# Altium schematic sheet POWER_PART.SchDoc
size A4
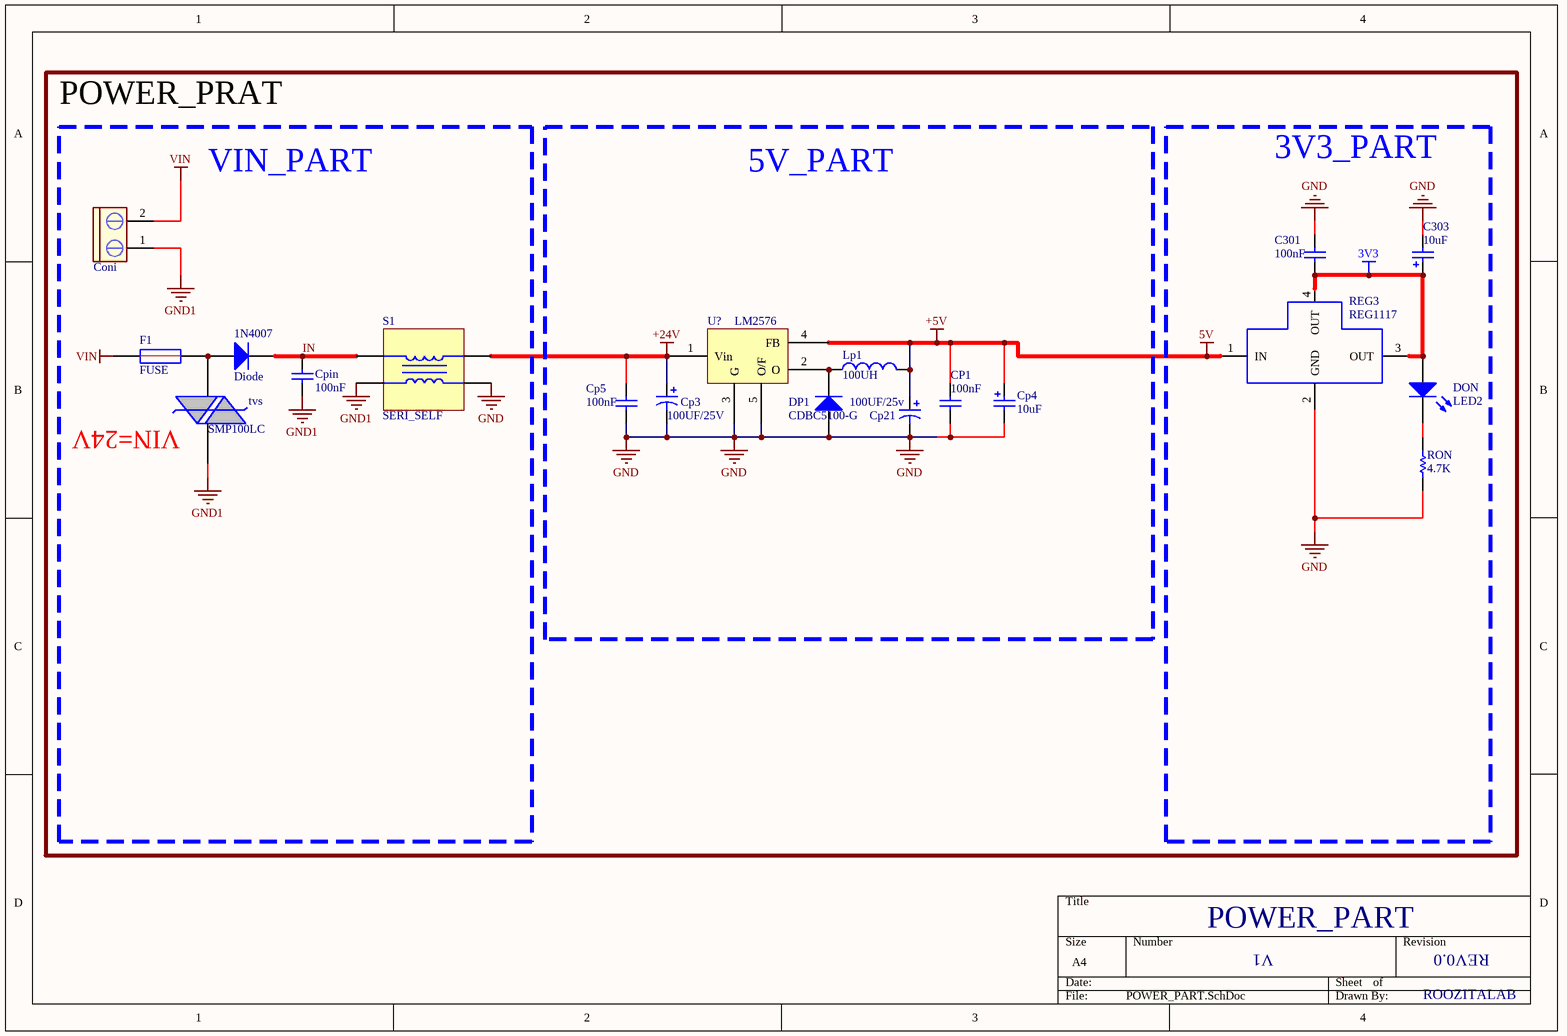
[diagram p0: POWER_PART.SchDoc]

## Parts
1N4007  Diode  [SMB]
C301  100nF  [0805.]
C303  10uF  [C1206.]
Coni  CON2 pin blue  [My_CN2]  (value not drawn)
CP1  100nF  [0805.]
Cp3  value 100UF/25V  [100UF25V]  (hidden comment: Cap Pol1)
Cp4  10uF  [C1206.]
Cp5  100nF  [0805.]
Cp21  value 100UF/25v  [100UF25V]  (hidden comment: Cap Pol1)
Cpin  100nF  [0805.]
DON  LED2  [0805.]
DP1  CDBC5100-G  [MY_SMC]
F1  FUSE  [1206]
Lp1  value 100UH  [indoctor100u]  (hidden comment: Inductor)
REG3  REG1117  [REG SMD]
RON  4.7K  [0805.]
S1  SERI_SELF  [SERI_SELF_SMALL]
tvs  SMP100LC  [TVS]
U?  LM2576  [d2pak5-lead]

## Nets
3V3: C301.1 C303.1 DON.1(A) REG3.3(OUT) REG3.4(OUT)
+5V: CP1.2 Cp4.1 Cp21.1 Lp1.2 REG3.1(IN) U?.4(FB)  [also labelled 5V]
+24V: Cp3.1 Cp5.2 S1.3 U?.1(Vin)
GND: C301.2 C303.2 CP1.1 Cp3.2 Cp4.2 Cp5.1 Cp21.2 DP1.A REG3.2(GND) RON.1 S1.4 U?.3(G) U?.5(O/F)
GND1: Coni.1 Cpin.2 S1.2 tvs.2
VIN: Coni.2 F1.2
IN: 1N4007.2(K) Cpin.1 S1.1
Net1N4007_1: 1N4007.1(A) F1.1 tvs.1
NetDON_2: DON.2(K) RON.2
NetDP1_K: DP1.K Lp1.1 U?.2(O)

## Notes on the sheet
- POWER_PRAT
- VIN_PART
- 5V_PART
- 3V3_PART
- (near tvs) VIN=24V
- POWER_PART
- V1
- REV0.0
- ROOZITALAB

## Library data of the parts
1N4007 = Diode: Default Diode; Published: 8-Jun-2000; LatestRevisionDate: 17-Jul-2002; LatestRevisionNote: Re-released for DXP Platform.; PackageVersion: Sep-1996; PackageReference: SMC; Publisher: Altium Limited; PackageDescription: DO-214-AB/SMC; 2 C-Bend Leads; Body 7.9 x 5.9 mm, inc. leads (LxW); Code_JEDEC: DO-214-AB
C301 CP1 Cp5 Cpin = Cap: Capacitor; Published: 8-Jun-2000; LatestRevisionDate: 17-Jul-2002; LatestRevisionNote: Re-released for DXP Platform.; PackageReference: RAD-0.3; Publisher: Altium Limited; PackageDescription: Radial Cap, Thru-Hole; 2 Leads; 0.3 in Pin Spacing; Value: 100nF
C303 Cp3 Cp4 Cp21 = Cap Pol1: Polarized Capacitor (Radial); Published: 8-Jun-2000; Publisher: Altium Limited
  C303 Cp4: Revision: July-2002: Re-released for DXP Platform.; Value: 10uF
  Cp3 Cp21: LatestRevisionDate: 17-Jul-2002; LatestRevisionNote: Re-released for DXP Platform.; PackageReference: RB7.6-15
Coni = CON2 pin blue: Connector blue screw
DON = LED2: Typical RED, GREEN, YELLOW, AMBER GaAs LED; Published: 8-Jun-2000; LatestRevisionDate: 17-Jul-2002; LatestRevisionNote: Re-released for DXP Platform.; PackageVersion: Feb-2002; PackageReference: 3.2X1.6X1.1; Publisher: Altium Limited; PackageDescription: SM LED; 2 Flat Leads
DP1 = 1N4007: 1 Amp Diode
Lp1 = Inductor: Code_IEC: 1005; Published: 8-Jun-2000; LatestRevisionDate: 17-Jul-2002; LatestRevisionNote: Re-released for DXP Platform.; PackageReference: 0402-A; Publisher: Altium Limited; Code_JEITA: 0402
RON = Res1: Resistor; Value: 1K; Published: 8-Jun-2000; Revision: July-2002: Re-released for DXP Platform.; Publisher: Altium Limited
U? = LM2576-5V